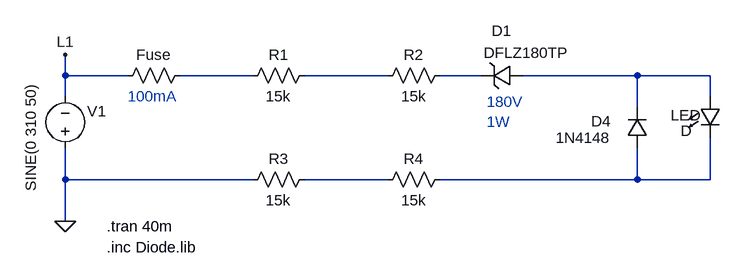
[diagram p0: schematic v1.1.asc]
v1.1.asc, the LTspice schematic file:
Version 4.1
SHEET 1 1084 680
WIRE -144 16 -144 -16
WIRE -48 16 -144 16
WIRE 144 16 32 16
WIRE 352 16 224 16
WIRE 496 16 432 16
WIRE 736 16 560 16
WIRE 848 16 736 16
WIRE -144 48 -144 16
WIRE 848 48 848 16
WIRE 736 64 736 16
WIRE -144 176 -144 128
WIRE 144 176 -144 176
WIRE 352 176 224 176
WIRE 736 176 736 128
WIRE 736 176 432 176
WIRE 848 176 848 112
WIRE 848 176 736 176
WIRE -144 240 -144 176
FLAG -144 240 0
FLAG -144 -16 L1
SYMBOL voltage -144 144 R180
WINDOW 123 0 0 Left 0
WINDOW 39 0 0 Left 0
WINDOW 0 -63 73 Left 2
WINDOW 3 53 -50 VRight 2
SYMATTR InstName V1
SYMATTR Value SINE(0 310 50)
SYMBOL res 240 0 R90
WINDOW 0 0 56 VBottom 2
WINDOW 3 32 56 VTop 2
SYMATTR InstName R1
SYMATTR Value 15k
SYMBOL res 448 0 R90
WINDOW 0 0 56 VBottom 2
WINDOW 3 32 56 VTop 2
SYMATTR InstName R2
SYMATTR Value 15k
SYMBOL res 240 160 R90
WINDOW 0 0 56 VBottom 2
WINDOW 3 32 56 VTop 2
SYMATTR InstName R3
SYMATTR Value 15k
SYMBOL res 448 160 R90
WINDOW 0 0 56 VBottom 2
WINDOW 3 32 56 VTop 2
SYMATTR InstName R4
SYMATTR Value 15k
SYMBOL zener 560 0 R90
WINDOW 0 -37 33 VBottom 2
WINDOW 3 -35 -6 VTop 2
SYMATTR InstName D1
SYMATTR Value DFLZ180TP
SYMBOL diode 752 128 R180
WINDOW 0 56 42 Left 2
WINDOW 3 57 16 Left 2
SYMATTR InstName D4
SYMATTR Value 1N4148
SYMBOL LED 832 48 R0
WINDOW 0 -45 29 Left 2
WINDOW 3 -29 53 Left 2
SYMATTR InstName LED
SYMBOL res 48 0 R90
WINDOW 0 0 56 VBottom 2
WINDOW 3 32 56 Invisible 2
SYMATTR InstName Fuse
SYMATTR Value 0
TEXT -80 248 Left 2 !.tran 40m
TEXT -80 280 Left 2 !.inc Diode.lib
TEXT 504 56 Left 2 ;180V\n1W
TEXT -48 48 Left 2 ;100mA

The netlist it stands for:
* v1.1.asc
V1 0 L1 SINE(0 310 50)
R1 N002 N001 15k
R2 N003 N002 15k
R3 N005 0 15k
R4 N006 N005 15k
D1 N004 N003 DFLZ180TP
D4 N006 N004 1N4148
D§LED N004 N006 D
R§Fuse N001 L1 0
.model D D
.lib standard.dio
.tran 40m
.inc Diode.lib
* 180V
* 1W
* 100mA
.backanno
.end